# EAGLE design R2R (EAGLE 9.6.2)
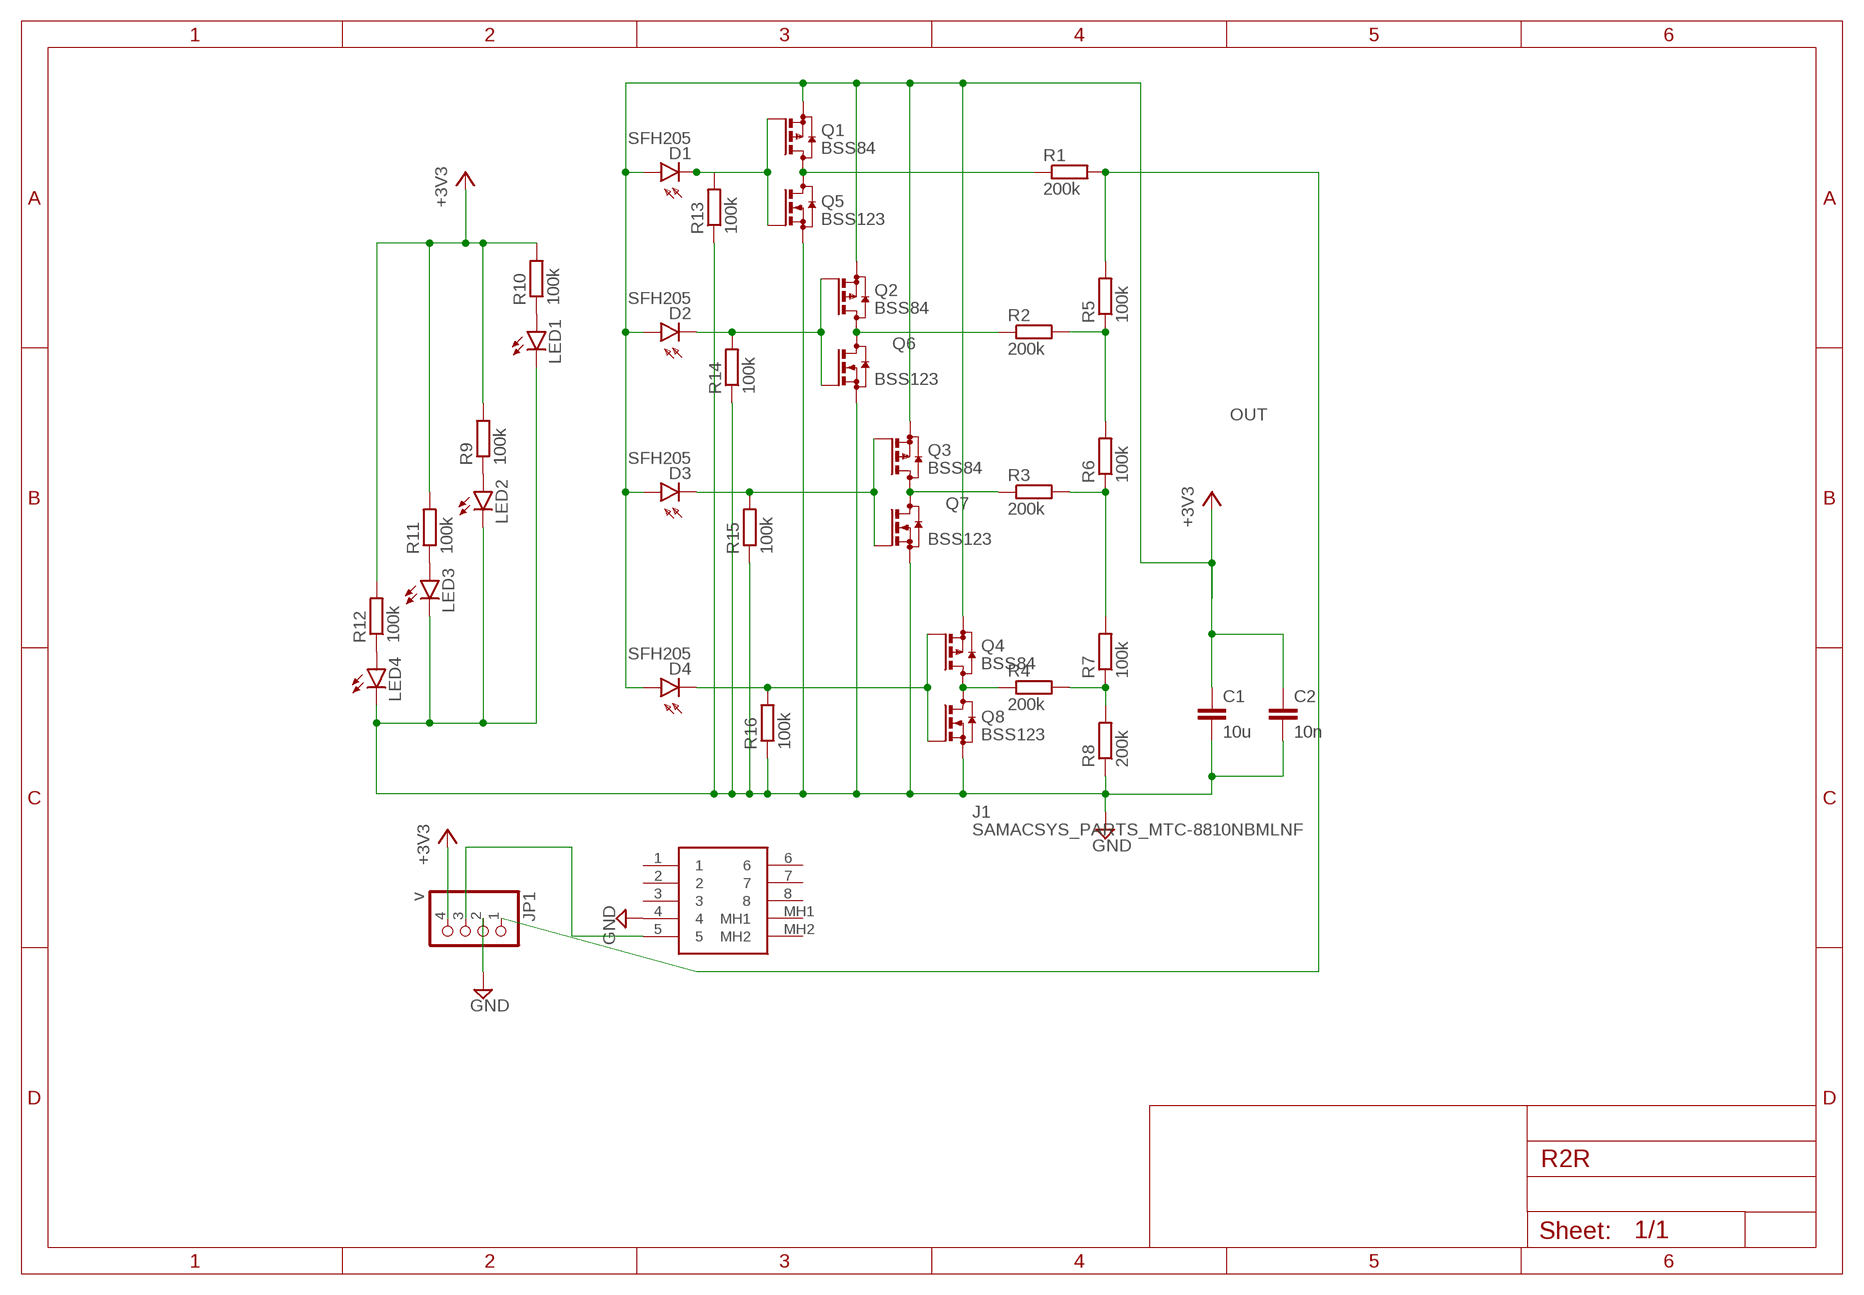
[diagram p0: schematic, sheet 1]

## Parts
C1  10u  C-EUC0805  [C0805]
C2  10n  C-EUC0805  [C0805]
D1  SFH205  [SFH205]
D2  SFH205  [SFH205]
D3  SFH205  [SFH205]
D4  SFH205  [SFH205]
J1  SAMACSYS_PARTS_MTC-8810NBMLNF  [SAMACSYS_PARTS_MTC8810NBMLNF]
JP1  v  PINHD-1X4  [1X04]
LED1  LED3MM  [LED3MM]
LED2  LED3MM  [LED3MM]
LED3  LED3MM  [LED3MM]
LED4  LED3MM  [LED3MM]
Q1  BSS84  [SOT23]
Q2  BSS84  [SOT23]
Q3  BSS84  [SOT23]
Q4  BSS84  [SOT23]
Q5  BSS123  [SOT23]
Q6  BSS123  [SOT23]
Q7  BSS123  [SOT23]
Q8  BSS123  [SOT23]
R1  200k  R-EU_R1206  [R1206]
R2  200k  R-EU_R1206  [R1206]
R3  200k  R-EU_R1206  [R1206]
R4  200k  R-EU_R1206  [R1206]
R5  100k  R-EU_R1206  [R1206]
R6  100k  R-EU_R1206  [R1206]
R7  100k  R-EU_R1206  [R1206]
R8  200k  R-EU_R1206  [R1206]
R9  100k  R-EU_R1206  [R1206]
R10  100k  R-EU_R1206  [R1206]
R11  100k  R-EU_R1206  [R1206]
R12  100k  R-EU_R1206  [R1206]
R13  100k  R-EU_R1206  [R1206]
R14  100k  R-EU_R1206  [R1206]
R15  100k  R-EU_R1206  [R1206]
R16  100k  R-EU_R1206  [R1206]

## Nets
+3V3: C1.1 C2.1 D1.A D2.A D3.A D4.A JP1.4 Q1.2(S) Q2.2(S) Q3.2(S) Q4.2(S) R9.2 R10.2 R11.2 R12.2
GND: C1.2 C2.2 J1.4 JP1.2 LED1.K(C) LED2.K(C) LED3.K(C) LED4.K(C) Q5.2(S) Q6.2(S) Q7.2(S) Q8.2(S) R8.1 R13.1 R14.1 R15.1 R16.1
N$1: Q1.3(D) Q5.3(D) R1.1
N$2: R2.2 R5.1 R6.2
N$3: R3.2 R6.1 R7.2
N$4: R4.2 R7.1 R8.2
N$5: D4.K(C) Q4.1(G) Q8.1(G) R16.2
N$6: Q3.3(D) Q7.3(D) R3.1
N$7: D2.K(C) Q2.1(G) Q6.1(G) R14.2
N$8: D1.K(C) Q1.1(G) Q5.1(G) R13.2
N$9: LED1.A R10.1
N$10: LED2.A R9.1
N$11: LED3.A R11.1
N$12: LED4.A R12.1
N$13: Q2.3(D) Q6.3(D) R2.1
N$14: J1.5 JP1.3
N$15: D3.K(C) Q3.1(G) Q7.1(G) R15.2
N$16: Q4.3(D) Q8.3(D) R4.1
OUT: JP1.1 R1.2 R5.2
Unconnected: J1.1 J1.2 J1.3 J1.6 J1.7 J1.8 J1.MH1 J1.MH2

## Library data of the parts
C1 C2 = rcl:C-EU: CAPACITOR, European symbol; SPICEPREFIX: C
D1-D4 = opto-trans-siemens:SFH205: PHOTO DIODE; OC_FARNELL: unknown; OC_NEWARK: unknown
J1 = Samac-RJ45:SAMACSYS_PARTS_MTC-8810NBMLNF: RS PRO Female Cat5 RJ45 Connector, PCB Mount RS Pro Cat5 RJ45 Connector Socket, Unshielded, Right Angle, PCB Mount Source: Datasheet <https://docs.rs-online.com/6e50/0900766b815bdd23.pdf>; DESCRIPTION: RS PRO Female Cat5 RJ45 Connector, PCB Mount RS Pro Cat5 RJ45 Connector Socket, Unshielded, Right Angle, PCB Mount; HEIGHT: 14.5mm; MANUFACTURER_NAME: RS Components; MANUFACTURER_PART_NUMBER: MTC-8810NBMLNF
JP1 = pinhead:PINHD-1X4: PIN HEADER
LED1-LED4 = led:LED: LED OSRAM: - CHIPLED LG R971, LG N971, LY N971, LG Q971, LY Q971, LO R971, LY R971 LH N974, LH R974 LS Q976, LO Q976, LY Q976 LO Q996 - Hyper CHIPLED LW Q18S LB Q993, LB Q99A, LB R99A - SideLED LS A670, LO A670, LY A670, LG A670, LP A670 LB A673, LV A673, LT A673, LW A673 LH A674 LY A675 LS A676, LA A676, LO A676, LY A676, LW A676 LS A679, LY A679, LG A679 - Hyper Micro SIDELED® LS Y876, LA Y876, LO Y876, LY Y876 LT Y87S - SmartLED LW L88C, LW L88S LB L89C, LB L89S, LG L890 LS L89K, LO L89K, LY L89K LS L896, LA L896, LO L896, LY L896 - TOPLED LS T670, LO T670, LY T670, LG T670, LP T670 LSG T670, LSP T670, LSY T670, LOP T670, LYG T670 LG T671, LOG T671, LSG T671 LB T673, LV T673, LT T673, LW T673 LH T674 LS T676, LA T676, LO T676, LY T676, LB T676, LH T676, LSB T676, LW T676 LB T67C, LV T67C, LT T67C, LS T67K, LO T67K, LY T67K, LW E67C LS E67B, LA E67B, LO E67B, LY E67B, LB E67C, LV E67C, LT E67C LW T67C LS T679, LY T679, LG T679 LS T770, LO T770, LY T770, LG T770, LP T770 LB T773, LV T773, LT T773, LW T773 LH T774 LS E675, LA E675, LY E675, LS T675 LS T776, LA T776, LO T776, LY T776, LB T776 LHGB T686 LT T68C, LB T68C - Hyper Mini TOPLED® LB M676 - Mini TOPLED Santana® LG M470 LS M47K, LO M47K, LY M47K Source: http://www.osram.convergy.de LUXEON: - LUMILED® LXK2-PW12-R00, LXK2-PW12-S00, LXK2-PW14-U00, LXK2-PW14-V00 LXK2-PM12-R00, LXK2-PM12-S00, LXK2-PM14-U00 LXK2-PE12-Q00, LXK2-PE12-R00, LXK2-PE12-S00, LXK2-PE14-T00, LXK2-PE14-U00 LXK2-PB12-K00, LXK2-PB12-L00, LXK2-PB12-M00, LXK2-PB14-N00, LXK2-PB14-P00, LXK2-PB14-Q00 LXK2-PR12-L00, LXK2-PR12-M00, LXK2-PR14-Q00, LXK2-PR14-R00 LXK2-PD12-Q00, LXK2-PD12-R00, LXK2-PD12-S00 LXK2-PH12-R00, LXK2-PH12-S00 LXK2-PL12-P00, LXK2-PL12-Q00, LXK2-PL12-R00 Source: www.luxeon.com KINGBRIGHT: KA-3528ASYC Source: www.kingbright.com
Q1-Q4 = transistor-small-signal:BSS84: P-CHANNEL MOS FET
Q5-Q8 = transistor-small-signal:BSS123: N-CHANNEL MOS FET
R1-R16 = rcl:R-EU_: RESISTOR, European symbol; SPICEPREFIX: R

## Board
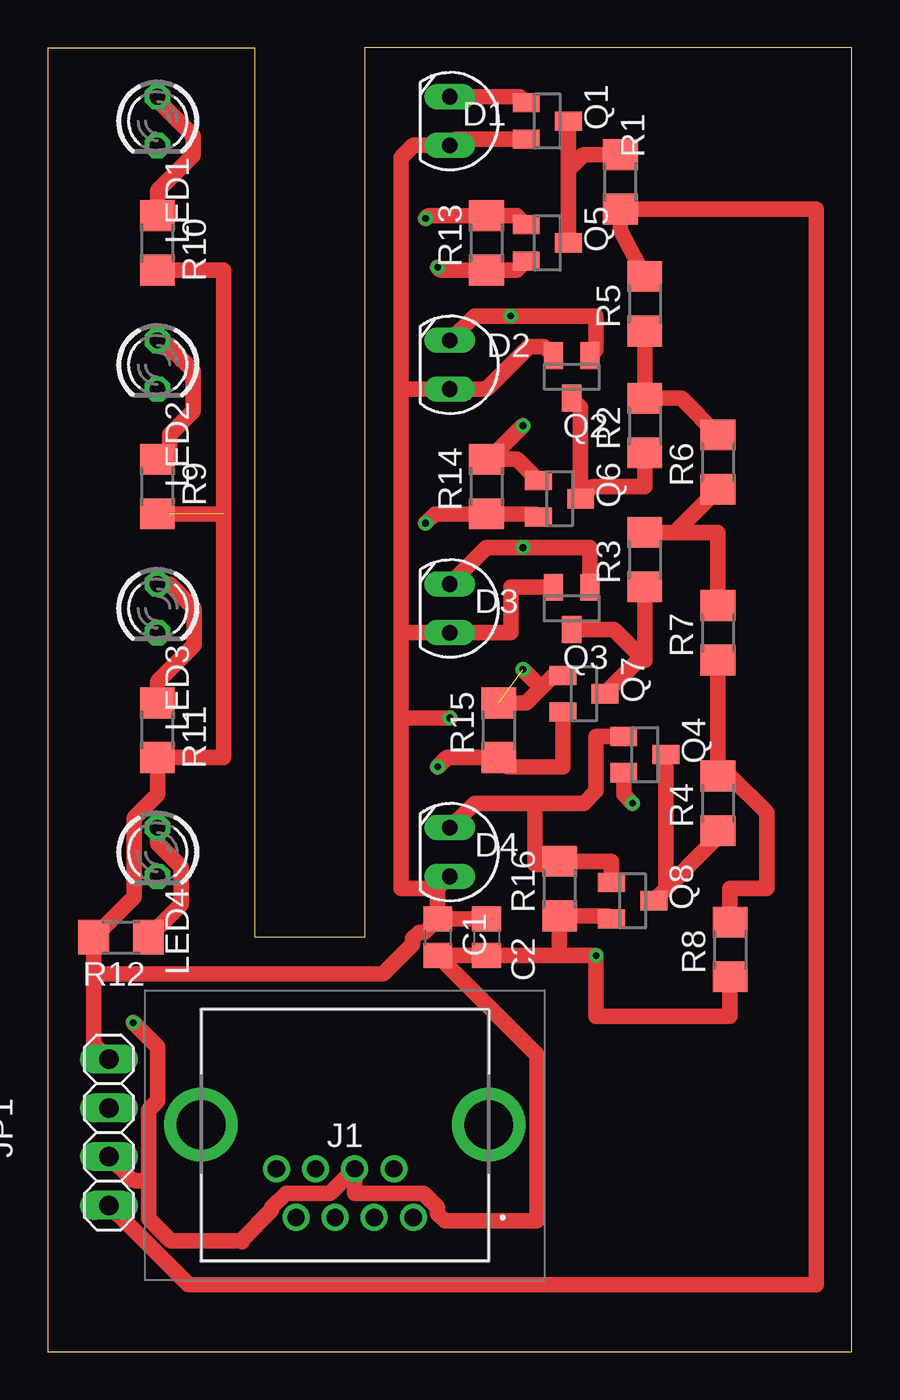
[diagram p1: board, top side]
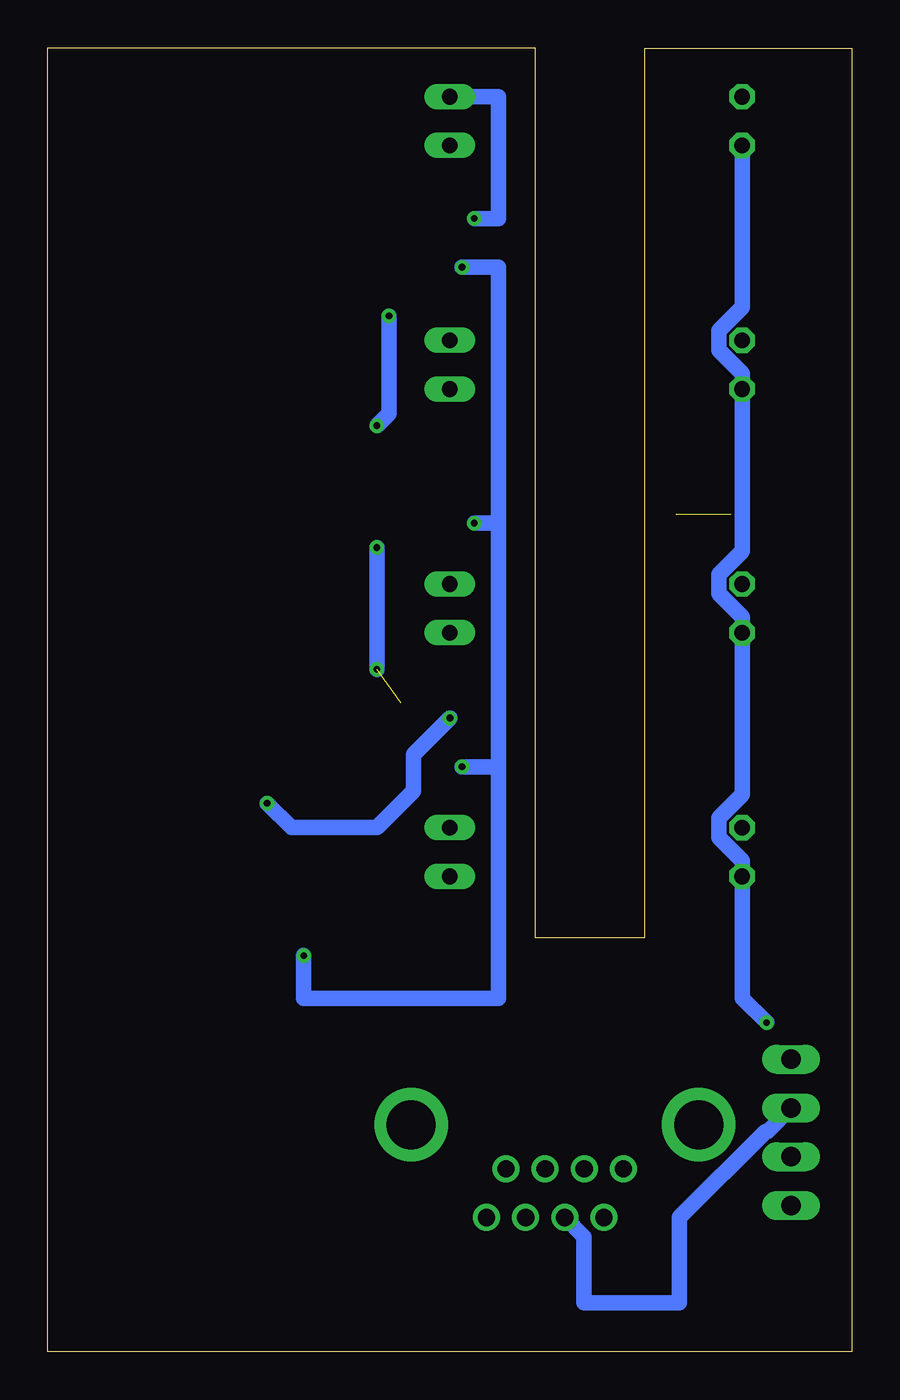
[diagram p2: board, bottom side, seen from below]

Size 41.91 x 67.95 mm. Coordinates in mm from the lower left corner, seen from the top.
Outline: 0,0 41.91,0 41.91,67.95 16.51,67.95 16.51,21.59 10.79,21.59 10.79,67.94 0,67.94 0,0
Copper layers (1*16): Top 0.035mm / dielectric 1.5mm / Bottom 0.035mm
Design rules "default": minimum track width 6mil, minimum drill 0.35mm, track to track 6mil, track to pad 6mil, pad to pad 6mil, via to via 6mil, smd to smd 6mil, copper to edge 40mil, drill to drill 6mil, minimum pad ring 10mil, minimum via ring 8mil, stop-mask expansion 4mil, vias tented up to drill 0mil, thermal gap 10mil

### Footprints (pad centres in the part's own frame; a part is rotated, then mirrored left to right if it is on the bottom)
C0805 = smd 1.3 x 1.5: 1 -0.95,0; 2 0.95,0
SFH205 = drill 0.813 long: A 0,-1.27; K 0,1.27
SAMACSYS_PARTS_MTC8810NBMLNF = drill 0.9 pad 1.4: 1 0,0; 2 1.02,-2.54; 3 2.04,0; 4 3.06,-2.54; 5 4.08,0; 6 5.1,-2.54; 7 6.12,0; 8 7.14,-2.54 | drill 2.55 pad 3.825: MH1 -3.93,-4.84; MH2 11.07,-4.84
1X04 = drill 1.016 long: 1 -3.81,0; 2 -1.27,0; 3 1.27,0; 4 3.81,0
LED3MM = drill 0.813 octagon: A -1.27,0; K 1.27,0
SOT23 = smd 1 x 1.4: 1 -0.95,-1.1; 2 0.95,-1.1; 3 0,1.1
R1206 = smd 1.6 x 1.803: 1 -1.422,0; 2 1.422,0

### Placement (x,y rotation side)
C1  20.32,21.59 270 top
C2  22.86,21.59 270 top
D1  20.96,64.14 0 top
D2  20.96,51.44 0 top
D3  20.96,38.73 0 top
D4  20.96,26.04 0 top
J1  19.05,6.99 180 top
JP1  3.18,11.43 90 top
LED1  5.71,64.14 270 top
LED2  5.71,51.44 270 top
LED3  5.71,38.73 270 top
LED4  5.71,26.04 270 top
Q1  26.04,64.14 270 top
Q2  27.31,50.8 180 top
Q3  27.31,38.73 180 top
Q4  31.11,31.12 270 top
Q5  26.04,57.78 270 top
Q6  26.67,44.45 270 top
Q7  27.94,34.29 270 top
Q8  30.48,23.5 270 top
R1  29.85,60.96 270 top
R2  31.11,48.26 90 top
R3  31.11,41.28 90 top
R4  34.92,28.58 90 top
R5  31.11,54.61 90 top
R6  34.92,46.36 90 top
R7  34.92,37.47 90 top
R8  35.56,20.96 90 top
R9  5.71,45.09 270 top
R10  5.71,57.78 270 top
R11  5.71,32.39 270 top
R12  3.81,21.59 180 top
R13  22.86,57.78 90 top
R14  22.86,45.09 90 top
R15  23.5,32.39 90 top
R16  26.67,24.13 90 top

### Tracks (layer width: path | path; a pad name or v marks a point on that pad's centre or on a via)
+3V3  (via drill 0.35)  (1 unrouted)
  Top 0.813: C2.1 C1.1 | 20.32,24.13 C1.1 | R10.2 9.17,56.36 9.17,43.66 R9.2 6.32,43.66 | R11.2 5.71,31.32 | R11.2 5.71,29.03 4.5,27.81 4.5,23.7 R12.2 2.39,19.69 | 2.39,19.69 17.46,19.69 19.01,21.23 19.01,21.52 19.34,21.85 19.63,21.85 C1.1 | 2.39,19.69 2.39,16.03 JP1.4 | R11.2 9.17,30.96 9.17,43.66 | 18.42,50.16 D2.A 22.86,50.16 25.08,52.39 25.86,52.39 Q2.2 | 18.42,50.16 18.42,62.23 19.05,62.87 D1.A 21.28,63.19 Q1.2 | 18.42,50.16 18.42,37.47 | 18.42,37.47 D3.A 24.13,37.47 24.13,39.84 Q3.2 | 18.42,37.47 18.42,33.02 | 18.42,33.02 18.42,24.13 20.32,24.13 | 20.32,24.13 D4.A | 18.42,33.02 v20.96,33.02 | v30.48,28.58 30.01,29.04 Q4.2
  Bottom 0.813: v20.96,33.02 22.86,31.12 22.86,29.21 24.76,27.3 29.21,27.3 v30.48,28.58
GND  (via drill 0.35)
  Top 0.813: v28.57,20.64 C2.2 C1.2 25.49,15.47 25.49,6.81 20.69,6.81 20.31,7.19 20.31,7.51 19.57,8.26 15.99,8.26 J1.4 14.71,8.25 12.41,8.25 11.67,7.51 11.67,7.38 10.07,5.78 | v28.57,20.64 28.57,17.47 35.56,17.47 R8.1 | 10.07,5.78 6.41,5.78 5.26,6.93 5.26,8.89 | 10.07,5.78 10.12,5.72 | v4.45,17.15 5.71,15.88 5.71,13.06 5.26,12.6 5.26,8.89 | JP1.2 4.39,8.94 4.48,8.94 4.54,8.89 5.26,8.89 | v20.32,56.52 20.47,56.36 R13.1 24.46,56.36 Q5.2 | v19.68,43.18 20.17,43.66 R14.1 25.41,43.66 Q6.2 | v20.32,30.48 20.8,30.96 R15.1 23.98,30.48 26.84,30.48 Q7.2 | v28.57,20.64 26.67,20.64 R16.1 29.22,22.71 Q8.2
  Bottom 0.813: LED1.K 5.71,54.43 6.93,53.21 6.93,52.2 5.71,50.98 LED2.K 5.71,41.73 6.93,40.51 6.93,39.5 5.71,38.28 LED3.K 5.71,29.03 6.93,27.81 6.93,26.8 5.71,25.58 LED4.K 5.71,18.41 v4.45,17.15 | v20.32,56.52 18.42,56.52 18.42,43.18 | 18.42,43.18 18.42,30.48 | 18.42,30.48 18.42,18.41 28.57,18.41 v28.57,20.64 | 18.42,43.18 v19.68,43.18 | 18.42,30.48 v20.32,30.48
N$1
  Top 0.813: Q1.3 Q5.3 27.14,61.59 27.92,62.38 R1.1
N$2
  Top 0.813: R5.1 R2.2 33.02,49.68 R6.2
N$3
  Top 0.813: R6.1 32.69,42.7 R3.2 34.92,42.7 R7.2
N$4
  Top 0.813: R7.1 R4.2 35.56,30 37.47,28.09 37.47,24.13 35.56,24.13 R8.2
N$5
  Top 0.813: D4.K 22.22,28.58 25.4,28.58 | 25.4,28.58 27.94,28.58 28.57,29.21 28.57,32.07 Q4.1 | 25.4,28.58 25.4,25.4 26.52,25.4 R16.2 29.38,25.55 Q8.1
N$6
  Top 0.813: Q3.3 29.5,37.64 30.94,36.2 | 30.94,36.2 31.11,36.03 R3.1 | Q7.3 30.94,36.2
N$7  (via drill 0.35)
  Top 0.813: D2.K 22.22,53.98 v24.13,53.98 28.57,53.98 28.57,52.22 Q2.1 | Q6.1 24.46,46.51 R14.2 23.01,46.51 v24.76,48.26
  Bottom 0.813: v24.76,48.26 24.13,48.9 v24.13,53.98
N$8  (via drill 0.35)
  Top 0.813: v19.68,59.06 19.84,59.21 R13.2 24.46,59.21 Q5.1 | D1.K 24.61,65.41 Q1.1
  Bottom 0.813: D1.K 18.42,65.41 18.42,59.06 v19.68,59.06
N$9
  Top 0.813: LED1.A 5.71,65.22 7.57,63.37 7.57,62.36 5.71,60.51 R10.1
N$10
  Top 0.813: R9.1 6.35,47.14 6.35,47.81 7.57,49.03 7.57,51.13 5.99,52.7 LED2.A
N$11
  Top 0.813: R11.1 5.71,34.93 7.62,36.83 7.62,38.73 6.35,40.01 LED3.A
N$12
  Top 0.813: LED4.A 5.71,26.49 6.93,25.27 6.93,23.29 R12.1
N$13
  Top 0.813: Q2.3 27.77,49.23 Q6.3 28.4,45.09 31.11,45.09 R2.1
N$14
  Bottom 0.813: J1.5 13.97,5.99 13.97,2.54 8.98,2.54 8.98,6.99 4.48,11.48 4.39,11.48 JP1.3
N$15  (via drill 0.35)  (1 unrouted)
  Top 0.813: D3.K 22.86,41.91 v24.76,41.91 28.25,41.91 Q3.1 | R15.2 24.92,33.81 26.35,35.24 Q7.1 | v24.76,35.56 25.4,34.93
  Bottom 0.813: v24.76,41.91 v24.76,35.56
N$16
  Top 0.813: Q4.3 32.22,24.13 Q8.3 35.08,27 R4.1
OUT
  Top 0.813: JP1.1 3.2,7.62 7.33,3.49 40.06,3.49 40.06,59.54 R1.2 | R5.2 29.85,58.44 R1.2 | R1.2